# EAGLE design 4403x8 Output Driver (EAGLE 5.11)
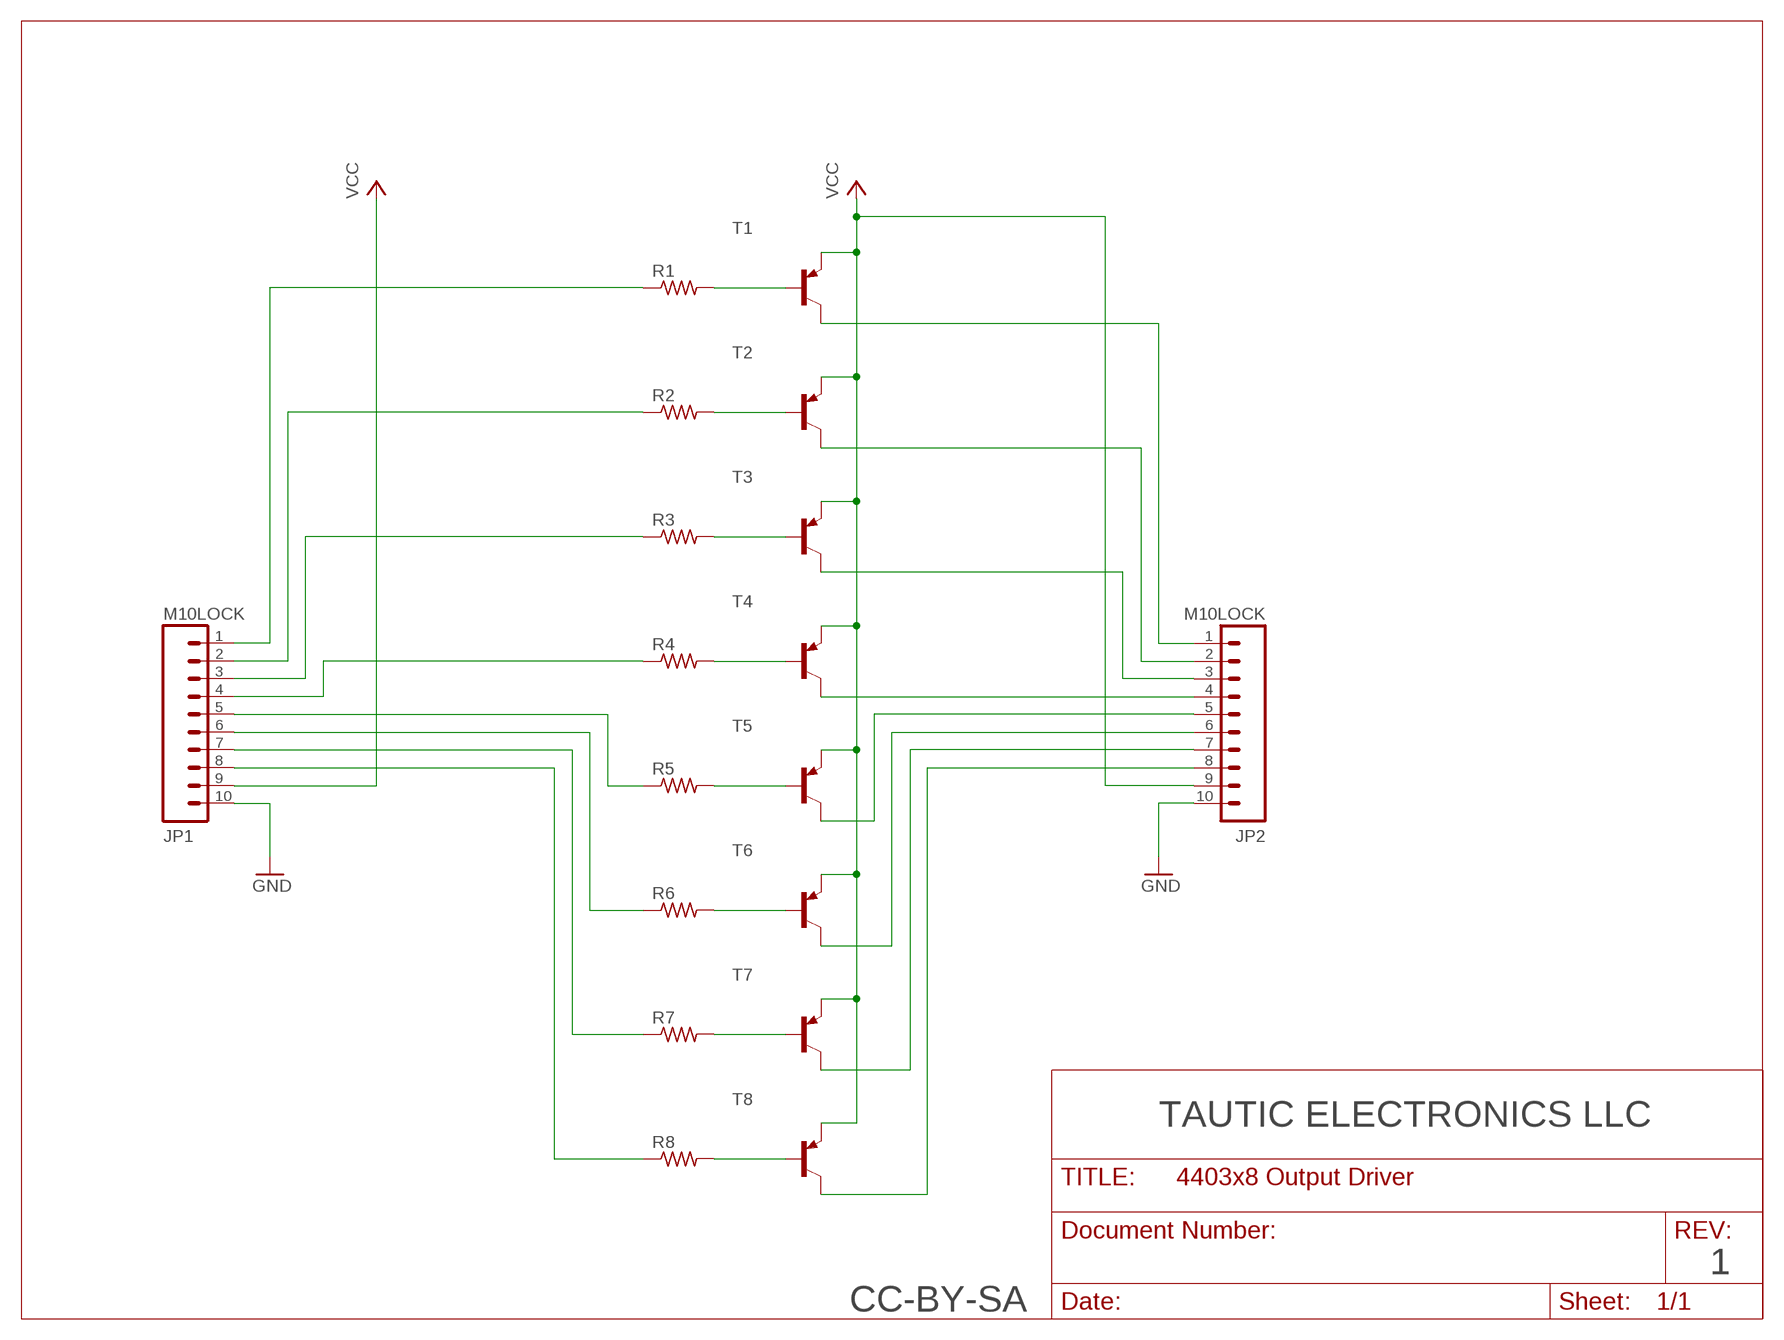
[diagram p0: schematic, sheet 1]

## Parts
JP1  M10LOCK  [1X10_LOCK]
JP2  M10LOCK  [1X10_LOCK]
R1  R-US_R0805  [R0805]
R2  R-US_R0805  [R0805]
R3  R-US_R0805  [R0805]
R4  R-US_R0805  [R0805]
R5  R-US_R0805  [R0805]
R6  R-US_R0805  [R0805]
R7  R-US_R0805  [R0805]
R8  R-US_R0805  [R0805]
T1  MMBT4403LT1-PNP-SOT23-BEC  [SOT23-BEC]
T2  MMBT4403LT1-PNP-SOT23-BEC  [SOT23-BEC]
T3  MMBT4403LT1-PNP-SOT23-BEC  [SOT23-BEC]
T4  MMBT4403LT1-PNP-SOT23-BEC  [SOT23-BEC]
T5  MMBT4403LT1-PNP-SOT23-BEC  [SOT23-BEC]
T6  MMBT4403LT1-PNP-SOT23-BEC  [SOT23-BEC]
T7  MMBT4403LT1-PNP-SOT23-BEC  [SOT23-BEC]
T8  MMBT4403LT1-PNP-SOT23-BEC  [SOT23-BEC]

## Nets
GND: JP1.10 JP2.10
N$1: JP2.1 T1.C
N$2: JP2.2 T2.C
N$3: JP2.3 T3.C
N$4: JP2.4 T4.C
N$5: JP2.5 T5.C
N$6: JP2.6 T6.C
N$7: JP2.7 T7.C
N$8: JP2.8 T8.C
N$9: JP1.1 R1.1
N$10: R1.2 T1.B
N$11: R2.2 T2.B
N$12: R3.2 T3.B
N$13: R4.2 T4.B
N$14: R5.2 T5.B
N$15: R6.2 T6.B
N$16: R7.2 T7.B
N$17: R8.2 T8.B
N$18: JP1.2 R2.1
N$19: JP1.3 R3.1
N$20: JP1.4 R4.1
N$21: JP1.5 R5.1
N$22: JP1.6 R6.1
N$23: JP1.7 R7.1
N$24: JP1.8 R8.1
VCC: JP1.9 JP2.9 T1.E T2.E T3.E T4.E T5.E T6.E T7.E T8.E

## Notes on the sheet
- TAUTIC ELECTRONICS LLC
- 1
- CC-BY-SA

## Library data of the parts
JP1 JP2 = SparkFun:M10: Header 10 Standard 10-pin 0.1" header. Use with straight break away headers (SKU : PRT-00116), right angle break away headers (PRT-00553), swiss pins (PRT-00743), machine pins (PRT-00117), and female headers (PRT-00115).
R1-R8 = rcl:R-US_: RESISTOR, American symbol
T1-T8 = transistor:*-PNP-: PNP Transistror

## Board
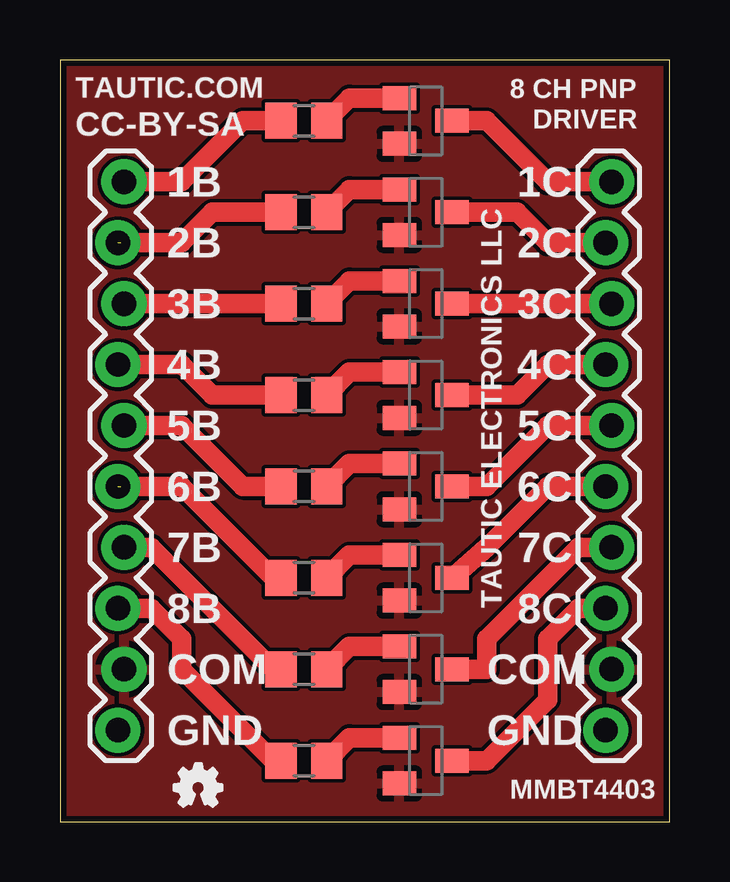
[diagram p1: board, top side]
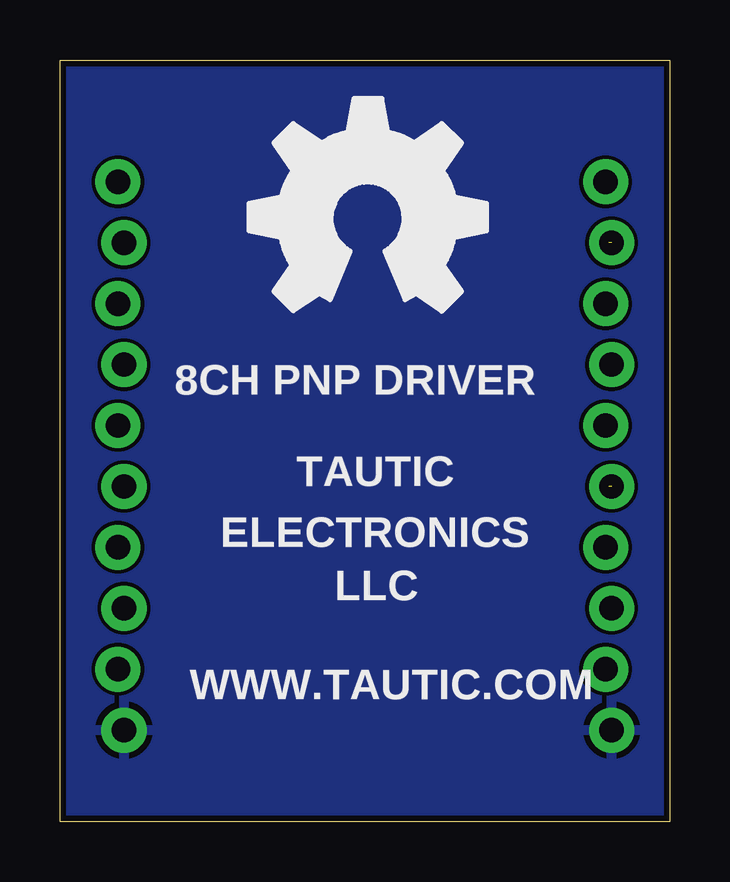
[diagram p2: board, bottom side, seen from below]

Size 25.4 x 31.75 mm. Coordinates in mm from the lower left corner, seen from the top.
Outline: 0,0 25.4,0 25.4,31.75 0,31.75 0,0
Copper layers (1*16): Top 0.035mm / dielectric 1.5mm / Bottom 0.035mm
Design rules "ITead_rule *": minimum track width 6mil, minimum drill 12mil, track to track 6mil, track to pad 6mil, pad to pad 6mil, via to via 6mil, smd to smd 0mil, copper to edge 10mil, drill to drill 10mil, minimum pad ring 10mil, minimum via ring 6mil, stop-mask expansion 2mil, vias tented up to drill 100mil, thermal gap 10mil

### Footprints (pad centres in the part's own frame; a part is rotated, then mirrored left to right if it is on the bottom)
1X10_LOCK = drill 1.016 pad 1.88 round: 1 0,0.127; 2 2.54,-0.127; 3 5.08,0.127; 4 7.62,-0.127; 5 10.16,0.127; 6 12.7,-0.127; 7 15.24,0.127; 8 17.78,-0.127; 9 20.32,0.127; 10 22.86,-0.127
R0805 = smd 1.3 x 1.5: 1 -0.95,0; 2 0.95,0
SOT23-BEC = smd 1 x 1.4: B -0.95,-1.1; C 0,1.1; E 0.95,-1.1

### Placement (x,y rotation side)
JP1  2.54,26.67 270 top
JP2  22.86,26.67 270 top
R1  10.16,29.21 0 top
R2  10.16,25.4 0 top
R3  10.16,21.59 0 top
R4  10.16,17.78 0 top
R5  10.16,13.97 0 top
R6  10.16,10.16 0 top
R7  10.16,6.35 0 top
R8  10.16,2.54 0 top
T1  15.24,29.21 270 top
T2  15.24,25.4 270 top
T3  15.24,21.59 270 top
T4  15.24,17.78 270 top
T5  15.24,13.97 270 top
T6  15.24,10.16 270 top
T7  15.24,6.35 270 top
T8  15.24,2.54 270 top
U$1  [OSHW_FILLX70_NOTEXT]  4.76,0.64 0 top
U$2  [OSHW_FILLX350_NOTEXT_BACK]  7.62,21.27 0 top

### Tracks (layer width: path | path; a pad name or v marks a point on that pad's centre or on a via)
GND
  pour Bottom: -2.54,35.56 27.94,35.56 27.94,-2.54 -2.54,-2.54
N$1
  Top 0.813: T1.C 17.78,29.21 20.32,26.67 JP2.1
N$2
  Top 0.813: T2.C 19.05,25.4 20.32,24.13 JP2.2
N$3
  Top 0.813: T3.C JP2.3
N$4
  Top 0.813: T4.C 19.05,17.78 20.32,19.05 JP2.4
N$5
  Top 0.813: T5.C 17.78,13.97 20.32,16.51 JP2.5
N$6
  Top 0.813: T6.C 17.78,11.43 20.32,13.97 JP2.6
N$7
  Top 0.813: T7.C 17.78,6.35 17.78,7.62 21.59,11.43 JP2.7
N$8
  Top 0.813: T8.C 17.78,2.54 20.32,5.08 20.32,7.62 21.59,8.89 JP2.8
N$9
  Top 0.813: R1.1 7.62,29.21 5.08,26.67 JP1.1
N$10
  Top 0.813: T1.B 12.06,30.16 R1.2
N$11
  Top 0.813: T2.B 12.06,26.35 R2.2
N$12
  Top 0.813: T3.B 12.06,22.54 R3.2
N$13
  Top 0.813: T4.B 12.06,18.73 R4.2
N$14
  Top 0.813: T5.B 12.06,14.92 R5.2
N$15
  Top 0.813: T6.B 12.06,11.11 R6.2
N$16
  Top 0.813: T7.B 12.06,7.3 R7.2
N$17
  Top 0.813: T8.B 12.06,3.49 R8.2
N$18  (1 unrouted)
  Top 0.813: R2.1 6.35,25.4 5.08,24.13 2.54,24.13
N$19
  Top 0.813: JP1.3 R3.1
N$20
  Top 0.813: R4.1 6.35,17.78 5.08,19.05 JP1.4
N$21
  Top 0.813: R5.1 7.62,13.97 5.08,16.51 JP1.5
N$22  (1 unrouted)
  Top 0.813: R6.1 8.89,10.16 5.08,13.97 2.54,13.97
N$23
  Top 0.813: R7.1 8.89,6.35 3.81,11.43 JP1.7
N$24
  Top 0.813: R8.1 8.89,2.54 5.08,6.35 5.08,7.62 3.81,8.89 JP1.8
VCC
  pour Top: -5.08,38.1 30.48,38.1 30.48,-5.08 -5.08,-5.08

### Text on the board
tPlace: TAUTIC.COM | 8 CH PNP | CC-BY-SA | DRIVER | 1B | 1C | 2B | 2C | 3B | 3C | 4B | 4C | 5B | 5C | 6B | 6C | 7B | 7C | TAUTIC ELECTRONICS LLC | 8B | 8C | COM | COM | GND | GND | MMBT4403
bPlace: 8CH PNP DRIVER | TAUTIC | ELECTRONICS | LLC | WWW.TAUTIC.COM